# EAGLE design rpiz_relay (EAGLE 7.7.0)
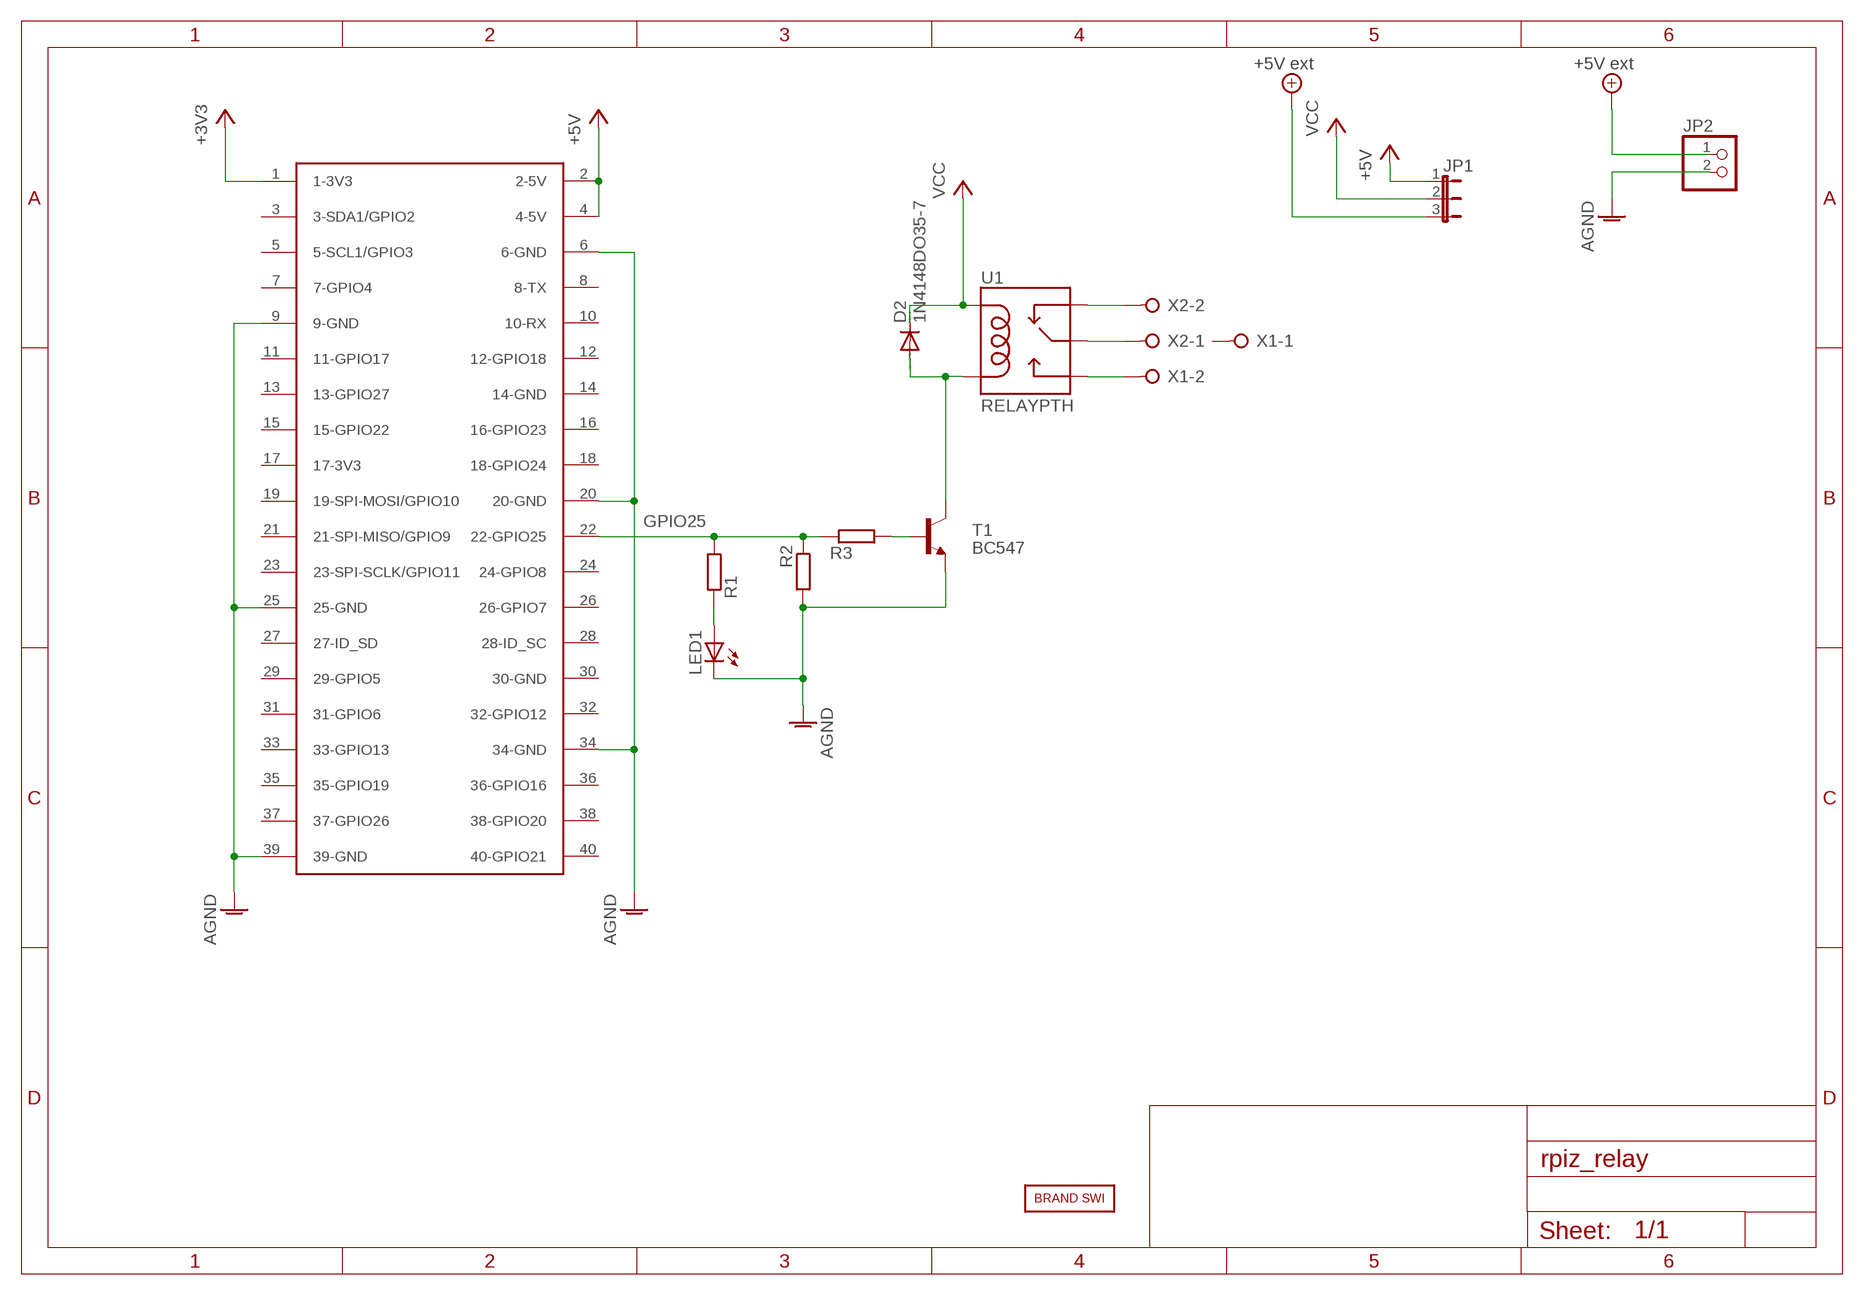
[diagram p0: schematic, sheet 1]

## Parts
D2  1N4148DO35-7  [DO35-7]
JP1  JP2E  [JP2]
JP2  PINHD-1X2  [1X02]
LED1  LEDCHIP-LED0805  [CHIP-LED0805]
R1  R-EU_R0805  [R0805]
R2  R-EU_R0805  [R0805]
R3  R-EU_R0805  [R0805]
T1  BC547  [TO92]
U1  RELAYPTH  [SRD-05VDC-SL-C]
U$1  RASPBERRY-PI+PIZERO  [RASPBERRY-PI-ZERO]
U$2  BRAND_SWI5X7  [BRAND_SWI_5X7]
X1  W237-02P  [W237-132]
X2  W237-02P  [W237-132]

## Nets
+3V3: U$1.1(1-3V3)
+5V: JP1.1 U$1.2(2-5V) U$1.4(4-5V)
+5V/1: JP1.3 JP2.1 ; supply symbol labelled +5V ext
AGND: JP2.2 LED1.C R2.2 T1.1(E) U$1.6(6-GND) U$1.9(9-GND) U$1.20(20-GND) U$1.25(25-GND) U$1.34(34-GND) U$1.39(39-GND)
GPIO25: R1.2 R2.1 R3.1 U$1.22(22-GPIO25)
N$1: U1.SWCLOSED(SWCLOSE) X2.2
N$2: U1.SWCOMMON X2.1
N$3: U1.SWOPEN X1.2
N$22: D2.A T1.3(C) U1.COIL0
N$27: R3.2 T1.2(B)
N$31: LED1.A R1.1
VCC: D2.C JP1.2 U1.COIL1
Unconnected: U$1.3(3-SDA1/GPIO2) U$1.5(5-SCL1/GPIO3) U$1.7(7-GPIO4) U$1.8(8-TX) U$1.10(10-RX) U$1.11(11-GPIO17) U$1.12(12-GPIO18) U$1.13(13-GPIO27) U$1.14(14-GND) U$1.15(15-GPIO22) U$1.16(16-GPIO23) U$1.17(17-3V3) U$1.18(18-GPIO24) U$1.19(19-SPI-MOSI/GPIO10) U$1.21(21-SPI-MISO/GPIO9) U$1.23(23-SPI-SCLK/GPIO11) U$1.24(24-GPIO8) U$1.26(26-GPIO7) U$1.27(27-ID_SD) U$1.28(28-ID_SC) U$1.29(29-GPIO5) U$1.30(30-GND) U$1.31(31-GPIO6) U$1.32(32-GPIO12) U$1.33(33-GPIO13) U$1.35(35-GPIO19) U$1.36(36-GPIO16) U$1.37(37-GPIO26) U$1.38(38-GPIO20) U$1.40(40-GPIO21) X1.1

## Library data of the parts
D2 = diode:1N4148: DIODE high speed (Philips)
JP1 = jumper:JP2E: JUMPER
JP2 = pinhead:PINHD-1X2: PIN HEADER
LED1 = led:LED: LED OSRAM: - CHIPLED LG R971, LG N971, LY N971, LG Q971, LY Q971, LO R971, LY R971 LH N974, LH R974 LS Q976, LO Q976, LY Q976 LO Q996 - Hyper CHIPLED LW Q18S LB Q993, LB Q99A, LB R99A - SideLED LS A670, LO A670, LY A670, LG A670, LP A670 LB A673, LV A673, LT A673, LW A673 LH A674 LY A675 LS A676, LA A676, LO A676, LY A676, LW A676 LS A679, LY A679, LG A679 - Hyper Micro SIDELED® LS Y876, LA Y876, LO Y876, LY Y876 LT Y87S - SmartLED LW L88C, LW L88S LB L89C, LB L89S, LG L890 LS L89K, LO L89K, LY L89K LS L896, LA L896, LO L896, LY L896 - TOPLED LS T670, LO T670, LY T670, LG T670, LP T670 LSG T670, LSP T670, LSY T670, LOP T670, LYG T670 LG T671, LOG T671, LSG T671 LB T673, LV T673, LT T673, LW T673 LH T674 LS T676, LA T676, LO T676, LY T676, LB T676, LH T676, LSB T676, LW T676 LB T67C, LV T67C, LT T67C, LS T67K, LO T67K, LY T67K, LW E67C LS E67B, LA E67B, LO E67B, LY E67B, LB E67C, LV E67C, LT E67C LW T67C LS T679, LY T679, LG T679 LS T770, LO T770, LY T770, LG T770, LP T770 LB T773, LV T773, LT T773, LW T773 LH T774 LS E675, LA E675, LY E675, LS T675 LS T776, LA T776, LO T776, LY T776, LB T776 LHGB T686 LT T68C, LB T68C - Hyper Mini TOPLED® LB M676 - Mini TOPLED Santana® LG M470 LS M47K, LO M47K, LY M47K Source: http://www.osram.convergy.de LUXEON: - LUMILED® LXK2-PW12-R00, LXK2-PW12-S00, LXK2-PW14-U00, LXK2-PW14-V00 LXK2-PM12-R00, LXK2-PM12-S00, LXK2-PM14-U00 LXK2-PE12-Q00, LXK2-PE12-R00, LXK2-PE12-S00, LXK2-PE14-T00, LXK2-PE14-U00 LXK2-PB12-K00, LXK2-PB12-L00, LXK2-PB12-M00, LXK2-PB14-N00, LXK2-PB14-P00, LXK2-PB14-Q00 LXK2-PR12-L00, LXK2-PR12-M00, LXK2-PR14-Q00, LXK2-PR14-R00 LXK2-PD12-Q00, LXK2-PD12-R00, LXK2-PD12-S00 LXK2-PH12-R00, LXK2-PH12-S00 LXK2-PL12-P00, LXK2-PL12-Q00, LXK2-PL12-R00 Source: www.luxeon.com KINGBRIGHT: KA-3528ASYC Source: www.kingbright.com
R1-R3 = rcl:R-EU_: RESISTOR, European symbol
T1 = transistor:BC547: NPN TRANSISTOR
U1 = SWI_COMMONS:RELAY: SPDT relay (COM-00101)
U$1 = Ava:RASPBERRY-PI+: Samtec SSW-120-01-T-D
U$2 = BRAND_SWI:BRAND_SWI
X1 X2 = con-wago-508:W237-02P: WAGO SREW CLAMP; OC_FARNELL: unknown; OC_NEWARK: unknown

## Board
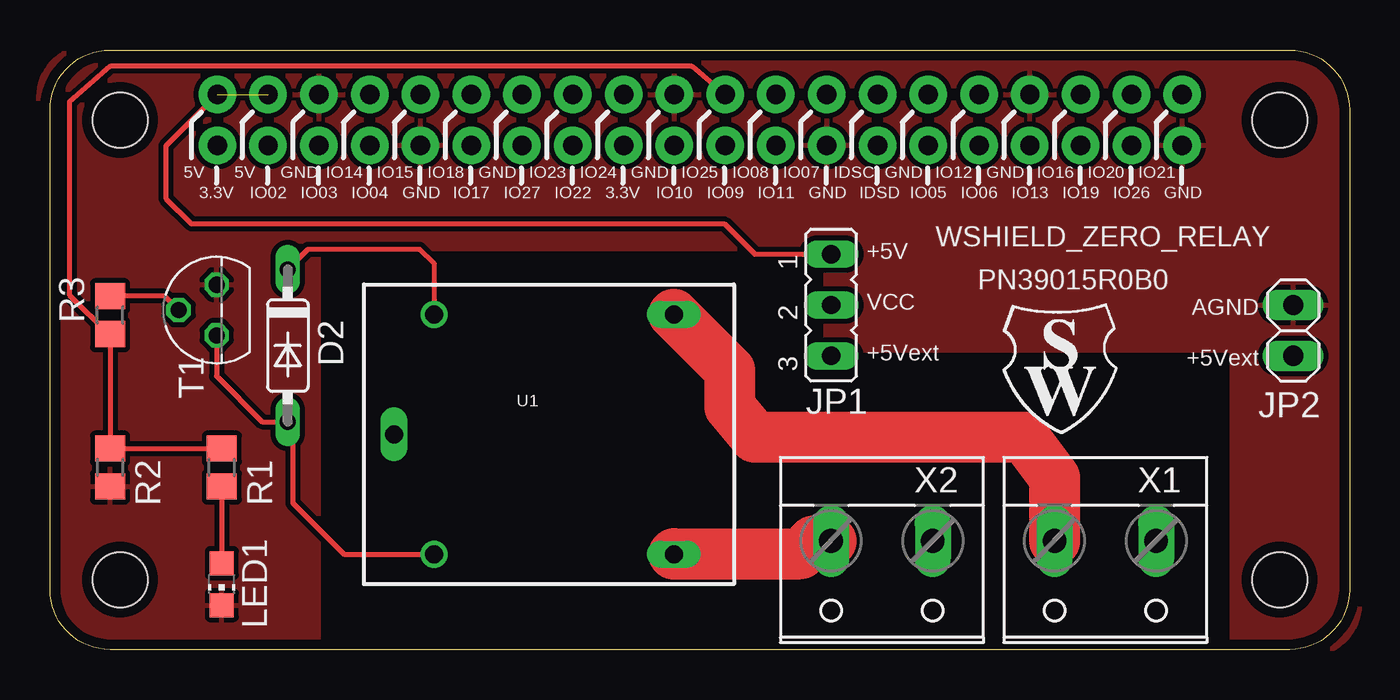
[diagram p1: board, top side]
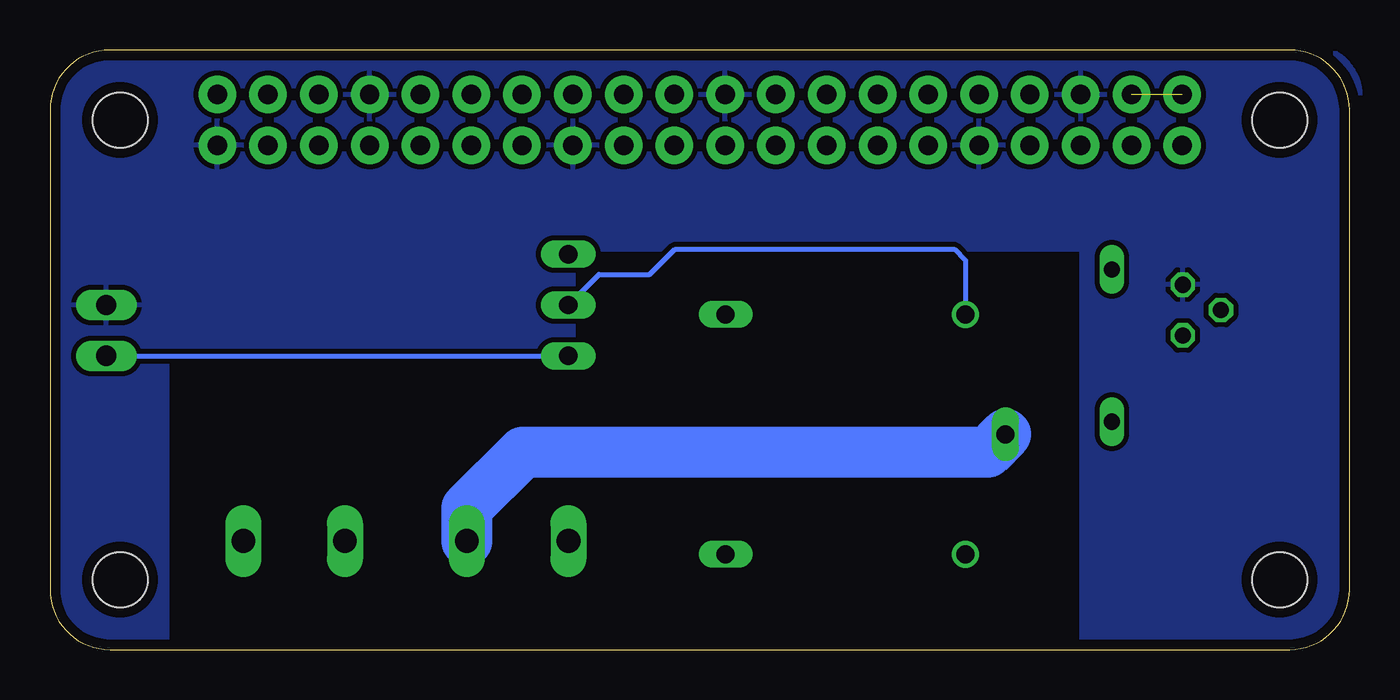
[diagram p2: board, bottom side, seen from below]

Size 65 x 30 mm. Coordinates in mm from the lower left corner, seen from the top.
Copper layers (1*16): Top 0.035mm / dielectric 1.6mm / Bottom 0.035mm
Design rules "Elecrow_2-layer_PCB_eagle_rule": minimum track width 6mil, minimum drill 12mil, track to track 6mil, track to pad 6mil, pad to pad 6mil, via to via 8mil, smd to smd 0mil, copper to edge 20mil, drill to drill 10mil, minimum pad ring 6mil, minimum via ring 6mil, stop-mask expansion 0mil, vias tented up to drill 100mil, thermal gap 10mil

### Footprints (pad centres in the part's own frame; a part is rotated, then mirrored left to right if it is on the bottom)
DO35-7 = drill 0.813 long: A 3.81,0; C -3.81,0
JP2 = drill 0.914 long: 1 -2.54,0; 2 0,0; 3 2.54,0
1X02 = drill 1.016 long: 1 -1.27,0; 2 1.27,0
CHIP-LED0805 = smd 1.2 x 1.2: A 0,-1.05; C 0,1.05
R0805 = smd 1.3 x 1.5: 1 -0.95,0; 2 0.95,0
TO92 = drill 0.813 octagon: 1 1.27,0; 2 0,1.905; 3 -1.27,0
SRD-05VDC-SL-C = drill 0.9: COIL0 -5.39,-6.12; COIL1 -5.39,5.88 | drill 0.9 long: SWCLOSED 6.61,-6.12; SWCOMMON -7.39,-0.12; SWOPEN 6.61,5.88
RASPBERRY-PI-ZERO = drill 0.97 pad 1.88: 1 -23.97,23.23; 2 -23.97,25.77; 3 -21.43,23.23; 4 -21.43,25.77; 5 -18.89,23.23; 6 -18.89,25.77; 7 -16.35,23.23; 8 -16.35,25.77; 9 -13.81,23.23; 10 -13.81,25.77; 11 -11.27,23.23; 12 -11.27,25.77; 13 -8.73,23.23; 14 -8.73,25.77; 15 -6.19,23.23; 16 -6.19,25.77; 17 -3.65,23.23; 18 -3.65,25.77; 19 -1.11,23.23; 20 -1.11,25.77; 21 1.43,23.23; 22 1.43,25.77; 23 3.97,23.23; 24 3.97,25.77; 25 6.51,23.23; 26 6.51,25.77; 27 9.05,23.23; 28 9.05,25.77; 29 11.59,23.23; 30 11.59,25.77; 31 14.13,23.23; 32 14.14,25.77; 33 16.67,23.23; 34 16.67,25.77; 35 19.21,23.23; 36 19.21,25.77; 37 21.75,23.23; 38 21.75,25.77; 39 24.29,23.23; 40 24.29,25.77 | hole 2.75: -28.84,24.5; 29.16,24.5; -28.84,1.5; 29.16,1.5
W237-132 = drill 1.194 long: 1 -2.54,-0.635; 2 2.54,-0.635

### Placement (x,y rotation side)
D2  11.89,15.21 270 top
JP1  39.07,17.24 270 top
JP2  62.19,15.97 90 top
LED1  8.59,3.27 180 top
R1  8.59,9.11 90 top
R2  3,9.11 270 top
R3  3,16.73 90 top
T1  8.34,16.99 90 top
U1  24.59,10.89 0 top
U$1  32.34,2 0 top
U$2  47.45,10.64 0 top
X1  52.79,4.79 180 top
X2  41.61,4.79 180 top

### Tracks (layer width: path | path; a pad name or v marks a point on that pad's centre or on a via)
+5V  (1 unrouted)
  Top 0.254: U$1.2 5.8,25.2 5.8,22.57 7.07,21.3 33.74,21.3 35.26,19.78 JP1.1
+5V/1
  Bottom 0.254: JP2.1 JP1.3
AGND
  pour Top (isolate 0.254): 13.42,-0.29 3.26,-0.29 arc-90 -0.55,3.52 -0.55,27.65 arc-90 1.99,30.19 5.8,30.19 61.68,30.19 arc-90 65.49,26.38 65.49,2.25 arc-90 62.95,-0.29 61.68,-0.29 59.14,-0.29 59.14,13.68 59.14,14.95 38.82,14.95 38.82,20.03 13.42,20.03
  pour Bottom (isolate 0.254): 13.42,-0.29 3.26,-0.29 arc-90 -0.55,3.52 -0.55,27.65 arc-90 1.99,30.19 5.8,30.19 61.68,30.19 arc-90 65.49,26.38 65.49,3.52 arc-90 61.68,-0.29 60.41,-0.29 59.14,-0.29 59.14,14.95 38.82,14.95 38.82,20.03 13.42,20.03
GPIO25
  Top 0.254: R1.2 R2.1 R3.1 2.94,15.78 0.97,17.75 0.97,27.4 3,29.18 32.11,29.18 U$1.22
N$1
  Top 2.54: U1.SWCLOSED 31.23,4.79 37.55,4.79 38.18,5.43 X2.2
N$2
  Bottom 2.54: U1.SWCOMMON 18.1,9.87 41.36,9.87 44.15,7.08 X2.1
N$3
  Top 2.54: U1.SWOPEN 33.99,13.98 33.99,12.16 35.26,10.64 48.72,10.64 50.25,8.6 X1.2
N$22
  Top 0.254: T1.3 8.34,13.68 10.62,11.4 D2.A 12.15,11.14 12.15,7.33 14.71,4.77 U1.COIL0
N$27
  Top 0.254: T1.2 5.74,17.68 R3.2
N$31
  Top 0.254: R1.1 LED1.A
VCC
  Top 0.254: D2.C 12.91,20.03 18.5,20.03 19.2,19.33 U1.COIL1
  Bottom 0.254: JP1.2 37.55,18.76 35.01,18.76 33.74,20.03 19.77,20.03 19.2,19.47 U1.COIL1

### Text on the board
tNames: 5V | 5V | GND | IO14 | IO15 | IO18 | GND | IO23 | IO24 | GND | IO25 | IO08 | IO07 | IDSC | GND | IO12 | GND | IO16 | IO20 | IO21 | 3.3V | IO02 | IO03 | IO04 | GND | IO17 | IO27 | IO22 | 3.3V | IO10 | IO09 | IO11 | GND | IDSD | IO05 | IO06 | IO13 | IO19 | IO26 | GND | WSHIELD_ZERO_RELAY | +5V | PN39015R0B0 | VCC | AGND | +5Vext | +5Vext